# Altium schematic sheet STM32.SchDoc
size A4
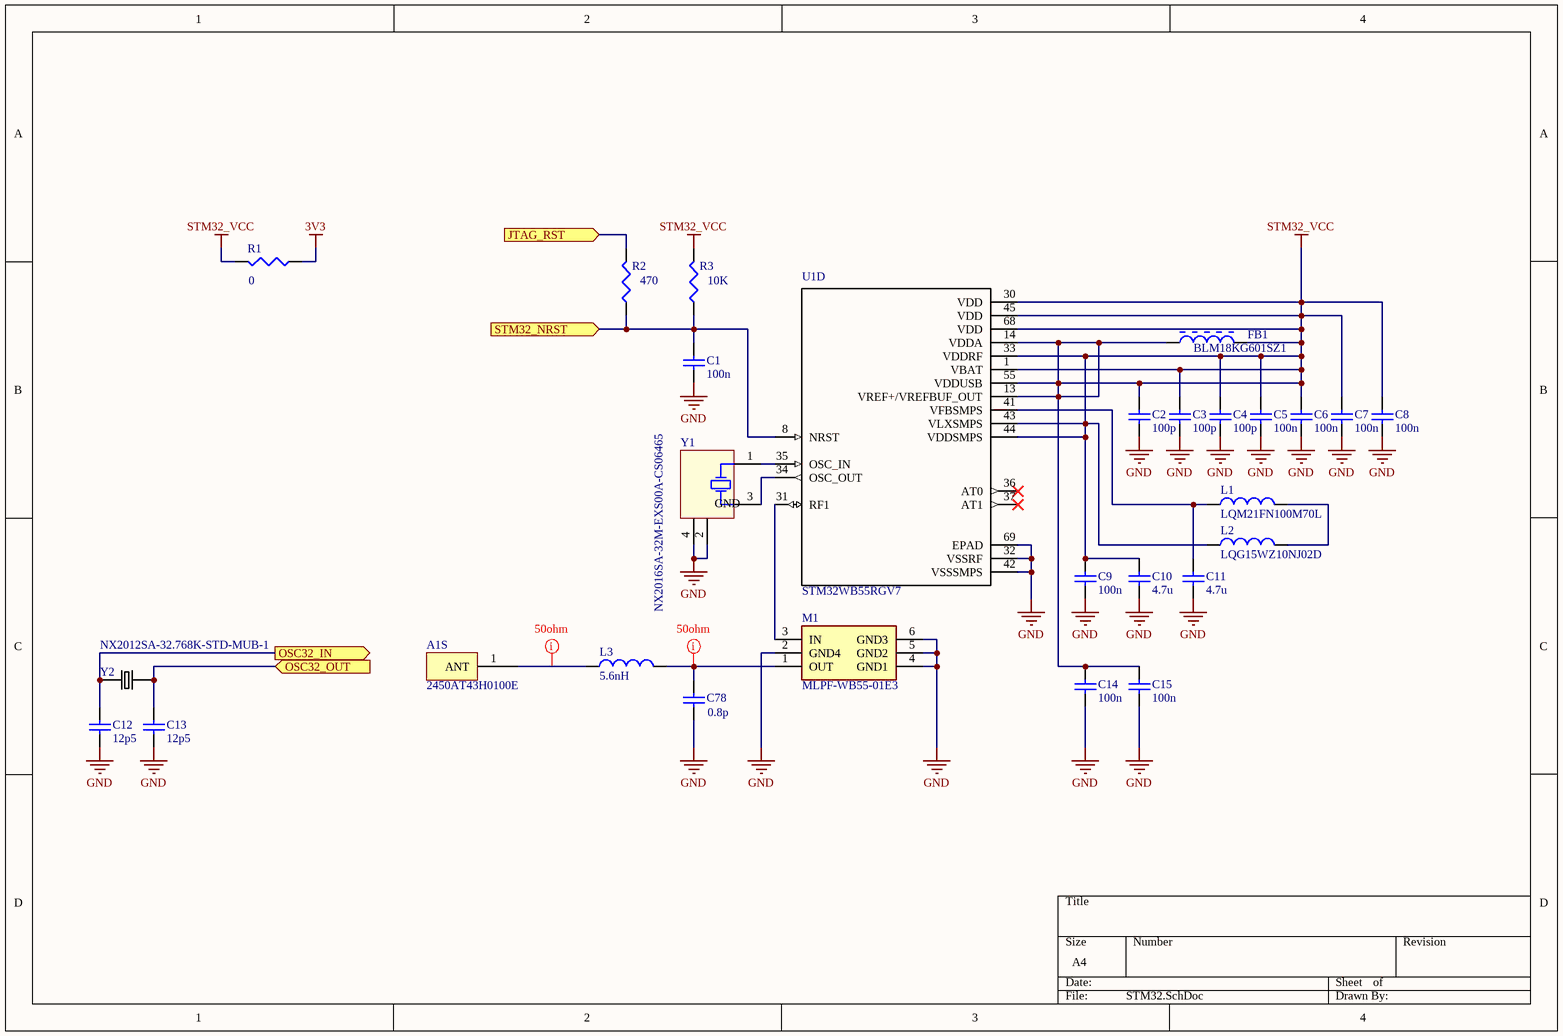
[diagram p0: STM32.SchDoc]

## Parts
A1S  2450AT43H0100E  [2450AT43H0100E]
C1  100n  [CAPC1608X90X35NL10T15]
C2  100p  [CAPC1608X90X35NL10T15]
C3  100p  [CAPC1608X90X35NL10T15]
C4  100p  [CAPC1608X90X35NL10T15]
C5  100n  [CAPC1608X90X35NL10T15]
C6  100n  [CAPC1608X90X35NL10T15]
C7  100n  [CAPC1608X90X35NL10T15]
C8  100n  [CAPC1608X90X35NL10T15]
C9  100n  [CAPC1608X90X35NL10T15]
C10  4.7u  [CAPC1608X90X35NL10T15]
C11  4.7u  [CAPC1608X90X35NL10T15]
C12  12p5  [CAPC1608X90X35NL10T15]
C13  12p5  [CAPC1608X90X35NL10T15]
C14  100n  [CAPC1608X90X35NL10T15]
C15  100n  [CAPC1608X90X35NL10T15]
C78  0.8p  [CAPC1005X55X25ML05T10]
FB1  BLM18KG601SZ1  [MURA-BLM18SG-B25-CHIP-2_V1]
L1  LQM21FN100M70L  [MURA-IND0805_L]
L2  LQG15WZ10NJ02D  [0402-A]
L3  5.6nH  [0402-A]
M1  MLPF-WB55-01E3  [MLPFWB5501E3]
R1  value 0  [J1-0603]
R2  value 470  [J1-0603]
R3  value 10K  [J1-0603]
U1  STM32WB55RGV7  [*QFN40P800X800X100-69N]  (part D of 4)
Y1  NX2016SA-32M-EXS00A-CS06465  [NDK-NX2016SA-26MHZ-EXS00A-CS06025-4_V]
Y2  NX2012SA-32.768K-STD-MUB-1  [*XTAL_NX2012SA-32.768K-STD-MUB-1]

## Ports
JTAG_RST (in), OSC32_IN (out), OSC32_OUT (in), STM32_NRST (in)

## Nets
3V3: R1.1
GND: C1.1 C2.1 C3.1 C4.1 C5.1 C6.1 C7.1 C8.1 C9.1 C10.1 C11.1 C12.1 C13.1 C14.1 C15.1 C78.1 M1.2(GND4) M1.4(GND1) M1.5(GND2) M1.6(GND3) U1.32(VSSRF) U1.42(VSSSMPS) U1.69(EPAD) Y1.2(GND) Y1.4(GND)
STM32_VCC: C2.2 C3.2 C4.2 C5.2 C6.2 C7.2 C8.2 C9.2 C10.2 C14.2 C15.2 FB1.1 FB1.2 L2.1 R1.2 R3.2 U1.1(VBAT) U1.13(VREF+/VREFBUF_OUT) U1.14(VDDA) U1.30(VDD) U1.33(VDDRF) U1.43(VLXSMPS) U1.44(VDDSMPS) U1.45(VDD) U1.55(VDDUSB) U1.68(VDD)
JTAG_RST: R2.2 ; port JTAG_RST
OSC32_IN: C12.2 Y2.1 ; port OSC32_IN
OSC32_OUT: C13.2 Y2.2 ; port OSC32_OUT
STM32_NRST: C1.2 R2.1 R3.1 U1.8(NRST) ; port STM32_NRST
NetA1S_1: A1S.1(ANT) L3.1
NetC11_2: C11.2 L1.1 U1.41(VFBSMPS)
NetC78_2: C78.2 L3.2 M1.1(OUT)
NetL1_2: L1.2 L2.2
NetM1_3: M1.3(IN) U1.31(RF1)
NetU1_34: U1.34(OSC_OUT) Y1.3(X2)
NetU1_35: U1.35(OSC_IN) Y1.1(X1)

Not connected (* = marked no-connect by the designer): U1 36(AT0)* 37(AT1)*

## Layout directives
rule Width Constraint [Pref Impedance = 50,00ohms    Min Impedance = 50,00ohms    Max Impedance = 50,00ohms]; rule Routing Layers [TopLayer - Enabled BottomLayer - Disabled]; rule Parallel Segment Constraint [Gap = 0.5mm    Limit = 10mm    Layer - Same Layer]: NetA1S_1, NetC78_2

## Library data of the parts
C1 C15 = CMP-2006-02891-1: Part Number: GRM188R71H102KA01D; Manufacturer: Murata
C2-C14 = CMP-2006-02891-1
C78 = CMP-2008-03945-1
FB1 = CMP-0686-00596-2: Chip Ferrite Bead for Power Lines (Low DC Resistance Type), 220 Ohm, 2500 mA, -55 to 125 degC, 1.6 x 0.8 x 0.65 mm SMD, Tape and Reel; Manufacturer: Murata; PartNumber: BLM18SG221TN1D; Impedance (at 100 MHz): 220 Ohm +/- 25%; DC Resistance: 0.040 Ohm Max.; Rated Current: 2500 mA; ComponentLink2Description: Datasheet; ComponentLink1Description: Manufacturer URL; ComponentLink3Description: Package Specification; DatasheetVersion: 08/2013; Packing: Tape and Reel; PackageReference: BLM18_H650-2; PackageDescription: 2-Pin Chip, Body 1.6 x 0.8 mm; Mounting Technology: Surface Mount; Operating Temperature Range: -55 to 125 degC; ComponentLink1URL: http://www.murata.com/; ComponentLink2URL: http://www.murata.com/products/catalog/pdf/c31e.pdf; ComponentLink3URL: http://www.murata.com/products/catalog/pdf/c31e.pdf
L1 = CMP-2000-06587-1: Fixed Inductor, 10 uH, +/-20%, -55 to 125 degC, 2-Pin SMD (0805), RoHS, Tape and Reel; Manufacturer: Murata; Tolerance (%): 20%; DC Resistance: 0.6; Inductance-Nom: 10H; Rated Current-Max: 100mA; Package Reference: IND0805; Case Size/Dimension: 0805; Manufacturer URL: http://www.murata.com/; Package Description: 2-Pin Surface Mount Device, Body 2 x 1.25 mm; Datasheet URL: http://psearch.en.murata.com/inductor/product/LQM21FN100M70%23.pdf; Mounting Technology: SurfaceMount; Datasheet Version: 05/2016
L2 L3 = Inductor: Code_IEC: 1005; Published: 8-Jun-2000; LatestRevisionDate: 29-May-2009; LatestRevisionNote: IPC-7351 Footprint Added.; PackageReference: 0402-A; Publisher: Altium Limited; PackageDescription: Chip Inductor; Code_JEITA: 0402
M1 = MLPF-WB55-01E3: Filter; Manufacturer_Name: STMicroelectronics; Datasheet Link: https://componentsearchengine.com/Datasheets/1/MLPF-WB55-01E3.pdf; Height: 0.7mm; Mouser Part Number: 511-MLPF-WB55-01E3; Mouser Price/Stock: https://www.mouser.com/Search/Refine.aspx?Keyword=511-MLPF-WB55-01E3; Manufacturer_Part_Number: MLPF-WB55-01E3
R1-R3 = Res3: Resistor; Published: 8-Jun-2000; LatestRevisionDate: 29-May-2009; LatestRevisionNote: IPC-7351 Footprint Added.; PackageReference: J1-0603; Publisher: Altium Limited; PackageDescription: Chip Resistor
U1 = STM32WB55RGV7: Multiprotocol wireless 32-bit MCU Arm-based Cortex-M4; MF: STMicroelectronics; MP: STM32WB55RGV7; Price: None; Package: None; Availability: Unavailable; SnapEDA_Link: https://www.snapeda.com/parts/STM32WB55RGV7/STMicroelectronics/view-part/?ref=snap; Value: *
Y1 = CMP-0454-00001-2: Crystal, 26 MHz, 8 pF, for OA / AV / Short-range Wireless, -10 to 75 degC, 2.0 x 1.6 x 0.45 mm SMD; PartNumber: NX2016SA-26MHZ-EXS00A-CS06025; Manufacturer: NDK; Level of drive: 10 uW (Max. 200 uW); Overtone Order: Fundamental; Load Capacitance: 8 pF; Nominal Frequency: 26 MHz; Operating Temperature: -10 to 75 degC; ComponentLink1Description: Manufacturer URL; ComponentLink3Description: Package Specification; ComponentLink3URL: http://www.ndk.com/images/products/catalog/c_NX2016SA-STD-CZS-1_e.pdf; PackageDescription: 4-Pin Hand Drawn, Body 2x1.6mm; Storage temperature range: -40 to 85 degC; ComponentLink1URL: https://www.ndk.com; Mounting Technology: Surface Mount; PackageReference: NX2016SA-26MHZ-EXS00A-CS06025-4; ComponentLink2Description: Datasheet; ComponentLink2URL: http://www.ndk.com/images/products/catalog/c_NX2016SA-STD-CZS-1_e.pdf
Y2 = NX2012SA-32.768K-STD-MUB-1: Crystal 32.7680khz 12.5pf Smd; MF: NDK America,; MP: NX2012SA-32.768K-STD-MUB-1; Price: None; Package: SMD-2 NDK; Availability: Unavailable; SnapEDA_Link: https://www.snapeda.com/parts/NX2012SA-32.768K-STD-MUB-1/NDK%20America%2C%20Inc./view-part/?ref=snap; Value: *